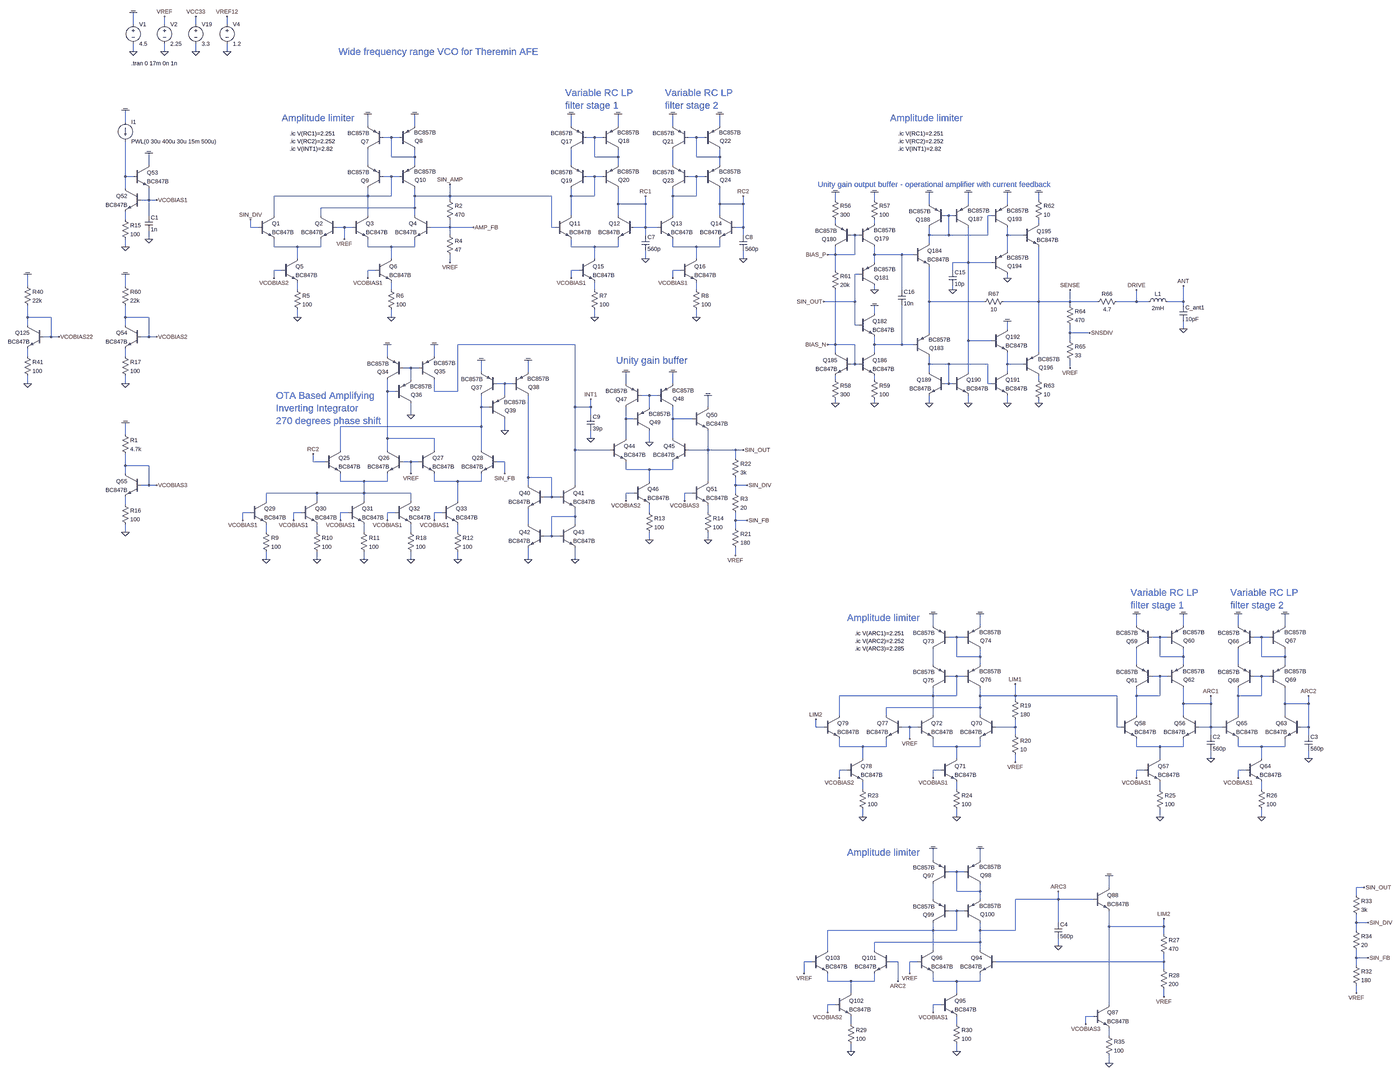
[diagram p0: schematic vco_sine_bjt_v01.asc, whole sheet]
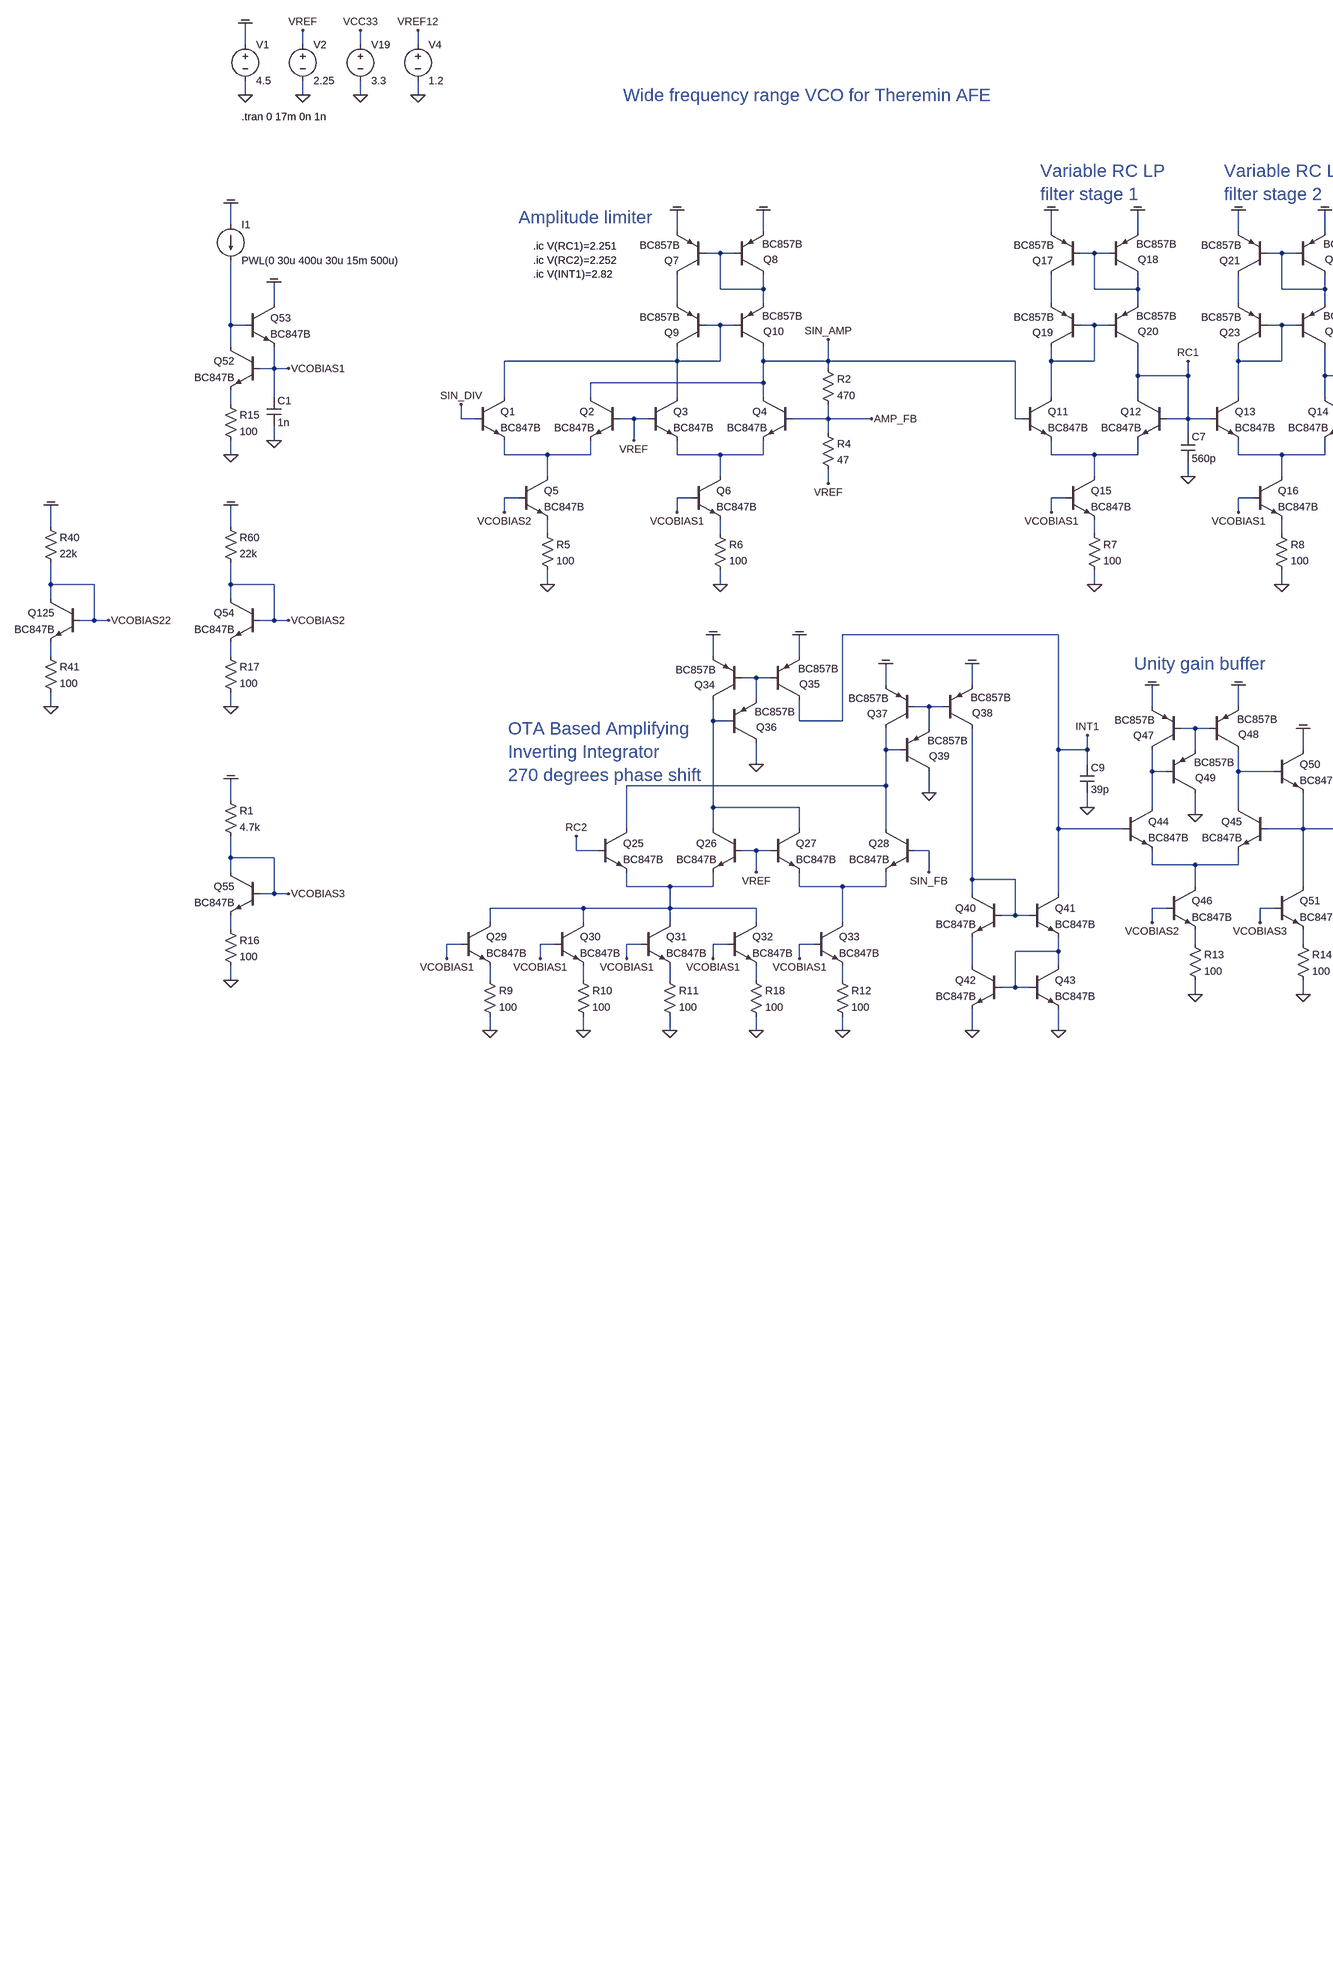
[diagram p1: schematic vco_sine_bjt_v01.asc, part, row 1 of 1, column 1 of 2]
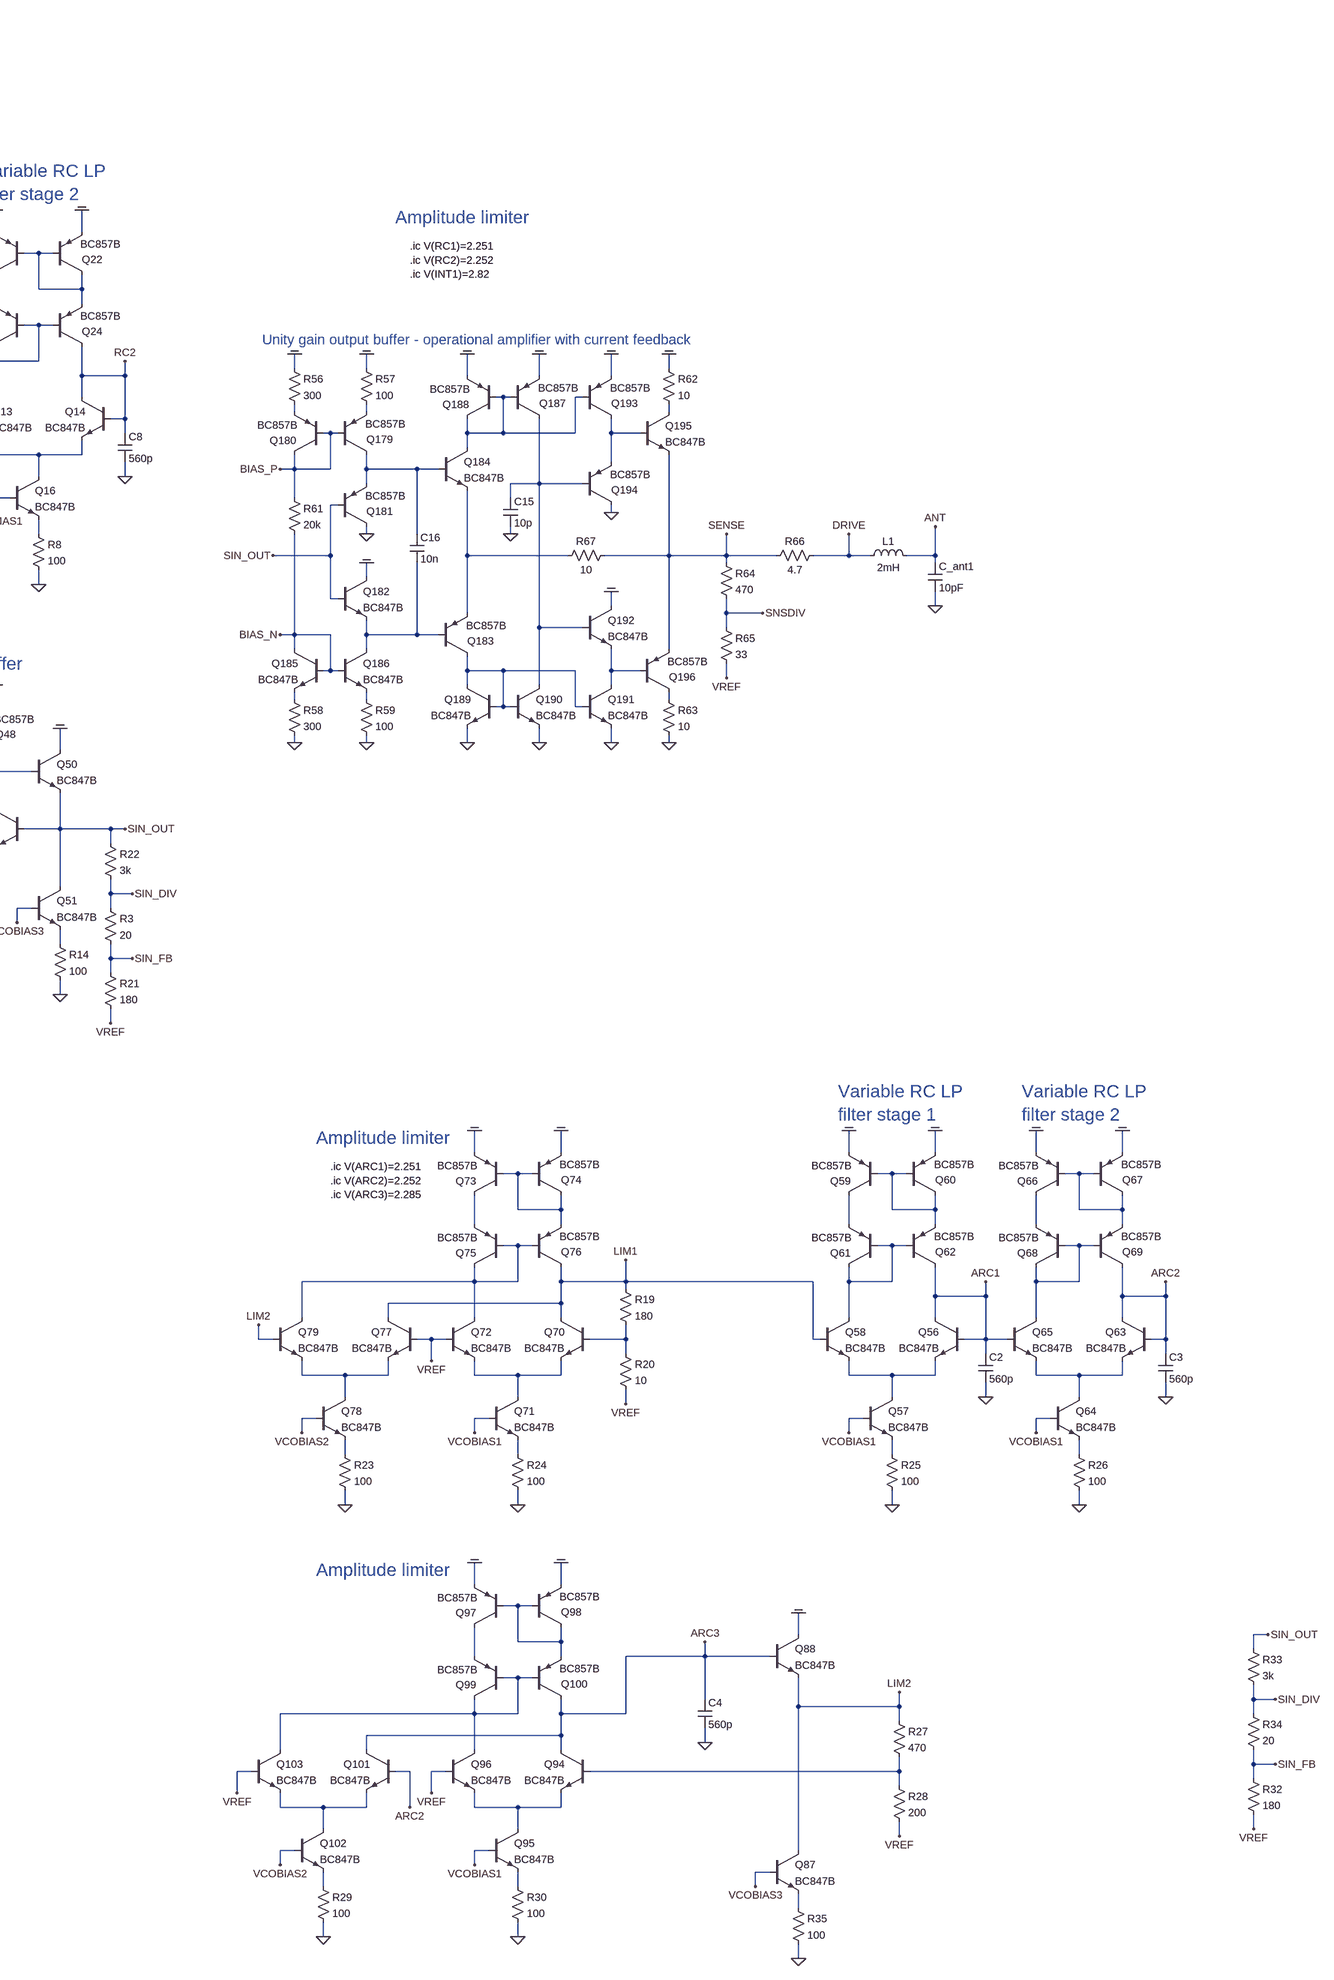
[diagram p2: schematic vco_sine_bjt_v01.asc, part, row 1 of 1, column 2 of 2]
vco_sine_bjt_v01.asc, the LTspice schematic file:
Version 4
SHEET 1 13504 19328
WIRE -432 13600 -432 13552
WIRE -304 13600 -304 13568
WIRE -176 13600 -176 13568
WIRE -48 13600 -48 13568
WIRE -432 13712 -432 13680
WIRE -304 13712 -304 13680
WIRE -176 13712 -176 13680
WIRE -48 13712 -48 13680
WIRE -464 14000 -464 13952
WIRE 528 14016 528 13968
WIRE 720 14016 720 13968
WIRE 1360 14016 1360 13968
WIRE 1552 14016 1552 13968
WIRE 1776 14016 1776 13968
WIRE 1968 14016 1968 13968
WIRE 624 14064 592 14064
WIRE 656 14064 624 14064
WIRE 1456 14064 1424 14064
WIRE 1488 14064 1456 14064
WIRE 1872 14064 1840 14064
WIRE 1904 14064 1872 14064
WIRE 624 14144 624 14064
WIRE 720 14144 720 14112
WIRE 720 14144 624 14144
WIRE 1456 14144 1456 14064
WIRE 1552 14144 1552 14112
WIRE 1552 14144 1456 14144
WIRE 1872 14144 1872 14064
WIRE 1968 14144 1968 14112
WIRE 1968 14144 1872 14144
WIRE -368 14176 -368 14128
WIRE 528 14176 528 14112
WIRE 720 14176 720 14144
WIRE 1360 14176 1360 14112
WIRE 1552 14176 1552 14144
WIRE 1776 14176 1776 14112
WIRE 1968 14176 1968 14144
WIRE -464 14224 -464 14080
WIRE -432 14224 -464 14224
WIRE 624 14224 592 14224
WIRE 656 14224 624 14224
WIRE 1456 14224 1424 14224
WIRE 1488 14224 1456 14224
WIRE 1872 14224 1840 14224
WIRE 1904 14224 1872 14224
WIRE -464 14272 -464 14224
WIRE 528 14304 528 14272
WIRE 528 14304 144 14304
WIRE 624 14304 624 14224
WIRE 624 14304 528 14304
WIRE 720 14304 720 14272
WIRE 864 14304 864 14256
WIRE 864 14304 720 14304
WIRE 1280 14304 864 14304
WIRE 1360 14304 1360 14272
WIRE 1456 14304 1456 14224
WIRE 1456 14304 1360 14304
WIRE 1776 14304 1776 14272
WIRE 1872 14304 1872 14224
WIRE 1872 14304 1776 14304
WIRE -368 14320 -368 14272
WIRE -368 14320 -400 14320
WIRE -336 14320 -368 14320
WIRE 864 14320 864 14304
WIRE 2576 14320 2576 14288
WIRE 2736 14320 2736 14288
WIRE 3408 14320 3408 14288
WIRE 1552 14336 1552 14272
WIRE 1664 14336 1664 14304
WIRE 1664 14336 1552 14336
WIRE 1968 14336 1968 14272
WIRE 2064 14336 2064 14304
WIRE 2064 14336 1968 14336
WIRE 2960 14336 2960 14288
WIRE 3120 14336 3120 14288
WIRE 3280 14336 3280 14288
WIRE 720 14352 720 14304
WIRE 720 14352 336 14352
WIRE -368 14384 -368 14320
WIRE 144 14384 144 14304
WIRE 336 14384 336 14352
WIRE 528 14384 528 14304
WIRE 720 14384 720 14352
WIRE 1360 14384 1360 14304
WIRE 1552 14384 1552 14336
WIRE 1776 14384 1776 14304
WIRE 1968 14384 1968 14336
WIRE 3040 14384 3024 14384
WIRE 3056 14384 3040 14384
WIRE 3216 14384 3200 14384
WIRE -464 14400 -464 14368
WIRE 2576 14416 2576 14400
WIRE 2736 14416 2736 14400
WIRE 3408 14416 3408 14400
WIRE 48 14432 48 14400
WIRE 80 14432 48 14432
WIRE 432 14432 400 14432
WIRE 464 14432 432 14432
WIRE 864 14432 864 14400
WIRE 864 14432 784 14432
WIRE 960 14432 864 14432
WIRE 1280 14432 1280 14304
WIRE 1296 14432 1280 14432
WIRE 1664 14432 1664 14336
WIRE 1664 14432 1616 14432
WIRE 1712 14432 1664 14432
WIRE 2064 14432 2064 14336
WIRE 2064 14432 2032 14432
WIRE 864 14464 864 14432
WIRE 1664 14464 1664 14432
WIRE 2064 14464 2064 14432
WIRE 2656 14464 2640 14464
WIRE 2672 14464 2656 14464
WIRE 2960 14464 2960 14432
WIRE 3040 14464 3040 14384
WIRE 3040 14464 2960 14464
WIRE 3200 14464 3200 14384
WIRE 3200 14464 3040 14464
WIRE 3280 14464 3280 14432
WIRE 3344 14464 3280 14464
WIRE -368 14480 -368 14448
WIRE 432 14480 432 14432
WIRE 2960 14496 2960 14464
WIRE -464 14512 -464 14480
WIRE 144 14512 144 14480
WIRE 240 14512 144 14512
WIRE 336 14512 336 14480
WIRE 336 14512 240 14512
WIRE 528 14512 528 14480
WIRE 624 14512 528 14512
WIRE 720 14512 720 14480
WIRE 720 14512 624 14512
WIRE 1360 14512 1360 14480
WIRE 1456 14512 1360 14512
WIRE 1552 14512 1552 14480
WIRE 1552 14512 1456 14512
WIRE 1776 14512 1776 14480
WIRE 1872 14512 1776 14512
WIRE 1968 14512 1968 14480
WIRE 1968 14512 1872 14512
WIRE 3280 14528 3280 14464
WIRE 2576 14544 2576 14512
WIRE 2576 14544 2544 14544
WIRE 2656 14544 2656 14464
WIRE 2656 14544 2576 14544
WIRE 2736 14544 2736 14512
WIRE 2848 14544 2736 14544
WIRE 2896 14544 2848 14544
WIRE 240 14560 240 14512
WIRE 624 14560 624 14512
WIRE 1456 14560 1456 14512
WIRE 1664 14560 1664 14528
WIRE 1872 14560 1872 14512
WIRE 2064 14560 2064 14528
WIRE 864 14576 864 14544
WIRE 2736 14576 2736 14544
WIRE 3120 14576 3120 14432
WIRE 3120 14576 3056 14576
WIRE 3216 14576 3120 14576
WIRE 176 14608 144 14608
WIRE 560 14608 528 14608
WIRE 1392 14608 1360 14608
WIRE 1808 14608 1776 14608
WIRE 2576 14608 2576 14544
WIRE 3056 14608 3056 14576
WIRE 2672 14624 2656 14624
WIRE 144 14640 144 14608
WIRE 528 14640 528 14608
WIRE 1360 14640 1360 14608
WIRE 1776 14640 1776 14608
WIRE 3280 14640 3280 14624
WIRE -864 14672 -864 14624
WIRE -464 14672 -464 14624
WIRE 240 14688 240 14656
WIRE 624 14688 624 14656
WIRE 1456 14688 1456 14656
WIRE 1872 14688 1872 14656
WIRE 2736 14688 2736 14672
WIRE 2848 14688 2848 14544
WIRE 3056 14688 3056 14672
WIRE 2656 14736 2656 14624
WIRE 2656 14736 2528 14736
WIRE 2960 14736 2960 14592
WIRE 3184 14736 2960 14736
WIRE 3408 14736 3408 14512
WIRE 3408 14736 3264 14736
WIRE 3536 14736 3536 14688
WIRE 3536 14736 3408 14736
WIRE 3648 14736 3536 14736
WIRE 3808 14736 3808 14688
WIRE 3808 14736 3728 14736
WIRE 3856 14736 3808 14736
WIRE 4000 14736 4000 14672
WIRE 4000 14736 3936 14736
WIRE 3536 14752 3536 14736
WIRE 4000 14752 4000 14736
WIRE 2736 14784 2736 14752
WIRE -864 14800 -864 14752
WIRE -768 14800 -864 14800
WIRE -464 14800 -464 14752
WIRE -368 14800 -464 14800
WIRE 240 14800 240 14768
WIRE 624 14800 624 14768
WIRE 1456 14800 1456 14768
WIRE 1872 14800 1872 14768
WIRE -864 14832 -864 14800
WIRE -464 14832 -464 14800
WIRE 2656 14832 2656 14736
WIRE 2672 14832 2656 14832
WIRE 3280 14848 3280 14816
WIRE 4000 14848 4000 14816
WIRE 2960 14864 2960 14736
WIRE 3536 14864 3536 14832
WIRE 3616 14864 3536 14864
WIRE -768 14880 -768 14800
WIRE -768 14880 -800 14880
WIRE -736 14880 -768 14880
WIRE -368 14880 -368 14800
WIRE -368 14880 -400 14880
WIRE -336 14880 -368 14880
WIRE 3120 14896 3120 14576
WIRE 3216 14896 3120 14896
WIRE 3536 14896 3536 14864
WIRE 1376 14912 896 14912
WIRE 2576 14912 2576 14688
WIRE 2576 14912 2544 14912
WIRE 2656 14912 2576 14912
WIRE 2736 14912 2736 14880
WIRE 2848 14912 2848 14752
WIRE 2848 14912 2736 14912
WIRE 2896 14912 2848 14912
WIRE 2576 14944 2576 14912
WIRE 2736 14944 2736 14912
WIRE 3408 14944 3408 14736
WIRE -864 14960 -864 14928
WIRE -464 14960 -464 14928
WIRE 608 14960 608 14912
WIRE 800 14960 800 14912
WIRE 2656 14992 2656 14912
WIRE 2656 14992 2640 14992
WIRE 2672 14992 2656 14992
WIRE 2960 14992 2960 14960
WIRE 3040 14992 2960 14992
WIRE 3200 14992 3040 14992
WIRE 3280 14992 3280 14944
WIRE 3344 14992 3280 14992
WIRE 704 15008 672 15008
WIRE 736 15008 704 15008
WIRE 3536 15008 3536 14976
WIRE 992 15024 992 14976
WIRE 1184 15024 1184 14976
WIRE 2960 15024 2960 14992
WIRE 3120 15024 3120 14896
WIRE 3280 15024 3280 14992
WIRE 704 15056 704 15008
WIRE 2576 15056 2576 15040
WIRE 2736 15056 2736 15040
WIRE 3408 15056 3408 15040
WIRE -864 15072 -864 15040
WIRE -464 15072 -464 15040
WIRE 1088 15072 1056 15072
WIRE 1120 15072 1088 15072
WIRE 1584 15072 1584 15024
WIRE 1776 15072 1776 15024
WIRE 3040 15072 3040 14992
WIRE 3040 15072 3024 15072
WIRE 3056 15072 3040 15072
WIRE 3200 15072 3200 14992
WIRE 3216 15072 3200 15072
WIRE 608 15104 608 15056
WIRE 640 15104 608 15104
WIRE 800 15104 800 15056
WIRE 896 15104 896 14912
WIRE 896 15104 800 15104
WIRE 1088 15120 1088 15072
WIRE 1680 15120 1648 15120
WIRE 1712 15120 1680 15120
WIRE 2576 15152 2576 15136
WIRE 2736 15152 2736 15136
WIRE 2960 15152 2960 15120
WIRE 3120 15152 3120 15120
WIRE 3280 15152 3280 15120
WIRE 3408 15152 3408 15136
WIRE 992 15168 992 15120
WIRE 1024 15168 992 15168
WIRE 1376 15168 1376 14912
WIRE 1440 15168 1440 15136
WIRE 1440 15168 1376 15168
WIRE 1680 15168 1680 15120
WIRE 1920 15168 1920 15120
WIRE 704 15200 704 15152
WIRE 1440 15200 1440 15168
WIRE 1584 15216 1584 15168
WIRE 1616 15216 1584 15216
WIRE 1776 15216 1776 15168
WIRE 1856 15216 1776 15216
WIRE 992 15248 992 15168
WIRE 992 15248 416 15248
WIRE 1088 15264 1088 15216
WIRE -464 15280 -464 15232
WIRE 608 15296 608 15104
WIRE 800 15296 608 15296
WIRE 1440 15296 1440 15264
WIRE 1584 15296 1584 15216
WIRE 1776 15296 1776 15216
WIRE 1680 15312 1680 15264
WIRE 416 15344 416 15248
WIRE 608 15344 608 15296
WIRE 800 15344 800 15296
WIRE 992 15344 992 15248
WIRE 1376 15344 1376 15168
WIRE 1520 15344 1376 15344
WIRE 1920 15344 1920 15264
WIRE 1920 15344 1840 15344
WIRE 2032 15344 1920 15344
WIRE 2064 15344 2032 15344
WIRE 2032 15376 2032 15344
WIRE 304 15392 304 15360
WIRE 352 15392 304 15392
WIRE 704 15392 672 15392
WIRE 736 15392 704 15392
WIRE 1088 15392 1056 15392
WIRE -464 15408 -464 15360
WIRE -368 15408 -464 15408
WIRE 1584 15424 1584 15392
WIRE 1680 15424 1584 15424
WIRE 1776 15424 1776 15392
WIRE 1776 15424 1680 15424
WIRE -464 15440 -464 15408
WIRE 704 15440 704 15392
WIRE 1088 15440 1088 15392
WIRE 1184 15456 1184 15120
WIRE 1280 15456 1184 15456
WIRE 416 15472 416 15440
WIRE 512 15472 416 15472
WIRE 608 15472 608 15440
WIRE 608 15472 512 15472
WIRE 800 15472 800 15440
WIRE 896 15472 800 15472
WIRE 992 15472 992 15440
WIRE 992 15472 896 15472
WIRE 1680 15472 1680 15424
WIRE 1920 15472 1920 15344
WIRE -368 15488 -368 15408
WIRE -368 15488 -400 15488
WIRE -336 15488 -368 15488
WIRE 1184 15488 1184 15456
WIRE 1376 15488 1376 15344
WIRE 2032 15488 2032 15456
WIRE 2080 15488 2032 15488
WIRE 320 15520 112 15520
WIRE 512 15520 512 15472
WIRE 512 15520 320 15520
WIRE 704 15520 512 15520
WIRE 1616 15520 1584 15520
WIRE 1856 15520 1824 15520
WIRE 2032 15520 2032 15488
WIRE 1280 15536 1280 15456
WIRE 1280 15536 1248 15536
WIRE 1312 15536 1280 15536
WIRE 112 15552 112 15520
WIRE 320 15552 320 15520
WIRE 512 15552 512 15520
WIRE 704 15552 704 15520
WIRE 896 15552 896 15472
WIRE 1584 15552 1584 15520
WIRE 1824 15552 1824 15520
WIRE -464 15568 -464 15536
WIRE 48 15600 16 15600
WIRE 256 15600 224 15600
WIRE 448 15600 416 15600
WIRE 640 15600 608 15600
WIRE 832 15600 800 15600
WIRE 1680 15600 1680 15568
WIRE 1920 15600 1920 15568
WIRE 1376 15616 1376 15584
WIRE 1376 15616 1280 15616
WIRE 16 15632 16 15600
WIRE 224 15632 224 15600
WIRE 416 15632 416 15600
WIRE 608 15632 608 15600
WIRE 800 15632 800 15600
WIRE 2032 15632 2032 15600
WIRE 2080 15632 2032 15632
WIRE 1184 15648 1184 15584
WIRE 1376 15648 1376 15616
WIRE 2032 15664 2032 15632
WIRE -464 15680 -464 15648
WIRE 112 15680 112 15648
WIRE 320 15680 320 15648
WIRE 512 15680 512 15648
WIRE 704 15680 704 15648
WIRE 896 15680 896 15648
WIRE 1280 15696 1280 15616
WIRE 1280 15696 1248 15696
WIRE 1312 15696 1280 15696
WIRE 1680 15712 1680 15680
WIRE 1920 15712 1920 15680
WIRE 2032 15776 2032 15744
WIRE 112 15792 112 15760
WIRE 320 15792 320 15760
WIRE 512 15792 512 15760
WIRE 704 15792 704 15760
WIRE 896 15792 896 15760
WIRE 1184 15792 1184 15744
WIRE 1376 15792 1376 15744
WIRE 2976 16176 2976 16128
WIRE 3168 16176 3168 16128
WIRE 3808 16176 3808 16128
WIRE 4000 16176 4000 16128
WIRE 4224 16176 4224 16128
WIRE 4416 16176 4416 16128
WIRE 3072 16224 3040 16224
WIRE 3104 16224 3072 16224
WIRE 3904 16224 3872 16224
WIRE 3936 16224 3904 16224
WIRE 4320 16224 4288 16224
WIRE 4352 16224 4320 16224
WIRE 3072 16304 3072 16224
WIRE 3168 16304 3168 16272
WIRE 3168 16304 3072 16304
WIRE 3904 16304 3904 16224
WIRE 4000 16304 4000 16272
WIRE 4000 16304 3904 16304
WIRE 4320 16304 4320 16224
WIRE 4416 16304 4416 16272
WIRE 4416 16304 4320 16304
WIRE 2976 16336 2976 16272
WIRE 3168 16336 3168 16304
WIRE 3808 16336 3808 16272
WIRE 4000 16336 4000 16304
WIRE 4224 16336 4224 16272
WIRE 4416 16336 4416 16304
WIRE 3072 16384 3040 16384
WIRE 3104 16384 3072 16384
WIRE 3904 16384 3872 16384
WIRE 3936 16384 3904 16384
WIRE 4320 16384 4288 16384
WIRE 4352 16384 4320 16384
WIRE 2976 16464 2976 16432
WIRE 2976 16464 2592 16464
WIRE 3072 16464 3072 16384
WIRE 3072 16464 2976 16464
WIRE 3168 16464 3168 16432
WIRE 3312 16464 3312 16416
WIRE 3312 16464 3168 16464
WIRE 3728 16464 3312 16464
WIRE 3808 16464 3808 16432
WIRE 3904 16464 3904 16384
WIRE 3904 16464 3808 16464
WIRE 4224 16464 4224 16432
WIRE 4320 16464 4320 16384
WIRE 4320 16464 4224 16464
WIRE 3312 16480 3312 16464
WIRE 4000 16496 4000 16432
WIRE 4112 16496 4112 16464
WIRE 4112 16496 4000 16496
WIRE 4416 16496 4416 16432
WIRE 4512 16496 4512 16464
WIRE 4512 16496 4416 16496
WIRE 3168 16512 3168 16464
WIRE 3168 16512 2784 16512
WIRE 2592 16544 2592 16464
WIRE 2784 16544 2784 16512
WIRE 2976 16544 2976 16464
WIRE 3168 16544 3168 16512
WIRE 3808 16544 3808 16464
WIRE 4000 16544 4000 16496
WIRE 4224 16544 4224 16464
WIRE 4416 16544 4416 16496
WIRE 2496 16592 2496 16560
WIRE 2528 16592 2496 16592
WIRE 2880 16592 2848 16592
WIRE 2912 16592 2880 16592
WIRE 3312 16592 3312 16560
WIRE 3312 16592 3232 16592
WIRE 3728 16592 3728 16464
WIRE 3744 16592 3728 16592
WIRE 4112 16592 4112 16496
WIRE 4112 16592 4064 16592
WIRE 4160 16592 4112 16592
WIRE 4512 16592 4512 16496
WIRE 4512 16592 4480 16592
WIRE 3312 16624 3312 16592
WIRE 4112 16624 4112 16592
WIRE 4512 16624 4512 16592
WIRE 2880 16640 2880 16592
WIRE 2592 16672 2592 16640
WIRE 2688 16672 2592 16672
WIRE 2784 16672 2784 16640
WIRE 2784 16672 2688 16672
WIRE 2976 16672 2976 16640
WIRE 3072 16672 2976 16672
WIRE 3168 16672 3168 16640
WIRE 3168 16672 3072 16672
WIRE 3808 16672 3808 16640
WIRE 3904 16672 3808 16672
WIRE 4000 16672 4000 16640
WIRE 4000 16672 3904 16672
WIRE 4224 16672 4224 16640
WIRE 4320 16672 4224 16672
WIRE 4416 16672 4416 16640
WIRE 4416 16672 4320 16672
WIRE 2688 16720 2688 16672
WIRE 3072 16720 3072 16672
WIRE 3904 16720 3904 16672
WIRE 4112 16720 4112 16688
WIRE 4320 16720 4320 16672
WIRE 4512 16720 4512 16688
WIRE 3312 16736 3312 16704
WIRE 2624 16768 2592 16768
WIRE 3008 16768 2976 16768
WIRE 3840 16768 3808 16768
WIRE 4256 16768 4224 16768
WIRE 2592 16800 2592 16768
WIRE 2976 16800 2976 16768
WIRE 3808 16800 3808 16768
WIRE 4224 16800 4224 16768
WIRE 2688 16848 2688 16816
WIRE 3072 16848 3072 16816
WIRE 3904 16848 3904 16816
WIRE 4320 16848 4320 16816
WIRE 2688 16960 2688 16928
WIRE 3072 16960 3072 16928
WIRE 3904 16960 3904 16928
WIRE 4320 16960 4320 16928
WIRE 2976 17200 2976 17152
WIRE 3168 17200 3168 17152
WIRE 3072 17248 3040 17248
WIRE 3104 17248 3072 17248
WIRE 3696 17312 3696 17264
WIRE 5248 17312 5216 17312
WIRE 3072 17328 3072 17248
WIRE 3168 17328 3168 17296
WIRE 3168 17328 3072 17328
WIRE 5216 17344 5216 17312
WIRE 2976 17360 2976 17296
WIRE 3168 17360 3168 17328
WIRE 3488 17360 3488 17328
WIRE 3488 17360 3312 17360
WIRE 3632 17360 3488 17360
WIRE 3072 17408 3040 17408
WIRE 3104 17408 3072 17408
WIRE 3488 17456 3488 17360
WIRE 5216 17456 5216 17424
WIRE 5264 17456 5216 17456
WIRE 3696 17472 3696 17408
WIRE 3920 17472 3920 17440
WIRE 3920 17472 3696 17472
WIRE 2976 17488 2976 17456
WIRE 2976 17488 2544 17488
WIRE 3072 17488 3072 17408
WIRE 3072 17488 2976 17488
WIRE 3168 17488 3168 17456
WIRE 3312 17488 3312 17360
WIRE 3312 17488 3168 17488
WIRE 5216 17488 5216 17456
WIRE 3920 17504 3920 17472
WIRE 3168 17536 3168 17488
WIRE 3168 17536 2736 17536
WIRE 3488 17552 3488 17520
WIRE 2544 17568 2544 17488
WIRE 2736 17568 2736 17536
WIRE 2976 17568 2976 17488
WIRE 3168 17568 3168 17536
WIRE 5216 17600 5216 17568
WIRE 5264 17600 5216 17600
WIRE 2480 17616 2448 17616
WIRE 2832 17616 2800 17616
WIRE 2912 17616 2880 17616
WIRE 3920 17616 3920 17584
WIRE 3920 17616 3232 17616
WIRE 5216 17632 5216 17600
WIRE 3920 17648 3920 17616
WIRE 2448 17664 2448 17616
WIRE 2880 17664 2880 17616
WIRE 2544 17696 2544 17664
WIRE 2640 17696 2544 17696
WIRE 2736 17696 2736 17664
WIRE 2736 17696 2640 17696
WIRE 2832 17696 2832 17616
WIRE 2976 17696 2976 17664
WIRE 3072 17696 2976 17696
WIRE 3168 17696 3168 17664
WIRE 3168 17696 3072 17696
WIRE 2640 17744 2640 17696
WIRE 3072 17744 3072 17696
WIRE 5216 17744 5216 17712
WIRE 3920 17760 3920 17728
WIRE 2576 17792 2544 17792
WIRE 3008 17792 2976 17792
WIRE 3696 17792 3696 17472
WIRE 2544 17824 2544 17792
WIRE 2976 17824 2976 17792
WIRE 3632 17840 3600 17840
WIRE 2640 17872 2640 17840
WIRE 3072 17872 3072 17840
WIRE 3600 17872 3600 17840
WIRE 3696 17920 3696 17888
WIRE 2640 17984 2640 17952
WIRE 3072 17984 3072 17952
WIRE 3696 18032 3696 18000
FLAG -432 13712 0
FLAG -432 13552 COM
FLAG -304 13712 0
FLAG -304 13568 VREF
FLAG -176 13712 0
FLAG -176 13568 VCC33
FLAG -48 13712 0
FLAG -48 13568 VREF12
FLAG -336 14320 VCOBIAS1
FLAG -464 14624 COM
FLAG -464 15232 COM
FLAG -464 13952 COM
FLAG -336 14880 VCOBIAS2
FLAG -336 15488 VCOBIAS3
FLAG -368 14128 COM
FLAG 1360 14640 VCOBIAS1
FLAG 1360 13968 COM
FLAG 1552 13968 COM
FLAG 1664 14304 RC1
FLAG 1664 14560 0
FLAG 1776 14640 VCOBIAS1
FLAG 1776 13968 COM
FLAG 1968 13968 COM
FLAG 2064 14304 RC2
FLAG 2064 14560 0
FLAG 224 15632 VCOBIAS1
FLAG 800 15632 VCOBIAS1
FLAG 992 14976 COM
FLAG 1184 14976 COM
FLAG 1440 15136 INT1
FLAG 704 15440 VREF
FLAG 1440 15296 0
FLAG 1824 15552 VCOBIAS3
FLAG 1920 15120 COM
FLAG 2032 15776 VREF
FLAG 608 14912 COM
FLAG 800 14912 COM
FLAG 1184 15792 0
FLAG 1376 15792 0
FLAG 1584 15552 VCOBIAS2
FLAG 1584 15024 COM
FLAG 1776 15024 COM
FLAG 1680 15312 0
FLAG 16 15632 VCOBIAS1
FLAG 704 15200 0
FLAG 1088 15264 0
FLAG 416 15632 VCOBIAS1
FLAG 528 14640 VCOBIAS1
FLAG 528 13968 COM
FLAG 720 13968 COM
FLAG 864 14576 VREF
FLAG 864 14256 SIN_AMP
FLAG 240 14800 0
FLAG 144 14640 VCOBIAS2
FLAG 432 14480 VREF
FLAG 2064 15344 SIN_OUT
FLAG 2080 15488 SIN_DIV
FLAG 48 14400 SIN_DIV
FLAG 304 15360 RC2
FLAG 2080 15632 SIN_FB
FLAG 624 14800 0
FLAG 1456 14800 0
FLAG 1872 14800 0
FLAG 112 15792 0
FLAG 320 15792 0
FLAG 512 15792 0
FLAG 896 15792 0
FLAG 1680 15712 0
FLAG 1920 15712 0
FLAG -464 14512 0
FLAG -464 15680 0
FLAG -464 15072 0
FLAG 1088 15440 SIN_FB
FLAG -368 14480 0
FLAG 608 15632 VCOBIAS1
FLAG 704 15792 0
FLAG -864 14624 COM
FLAG -736 14880 VCOBIAS22
FLAG -864 15072 0
FLAG 2576 15152 0
FLAG 2736 15152 0
FLAG 2736 14288 COM
FLAG 2576 14288 COM
FLAG 2736 14688 0
FLAG 2736 14752 COM
FLAG 2544 14912 BIAS_N
FLAG 2544 14544 BIAS_P
FLAG 3120 14288 COM
FLAG 2960 14288 COM
FLAG 2960 15152 0
FLAG 3120 15152 0
FLAG 3056 14688 0
FLAG 3280 15152 0
FLAG 3280 14816 COM
FLAG 3280 14288 COM
FLAG 3280 14640 0
FLAG 3408 14288 COM
FLAG 3408 15152 0
FLAG 3536 15008 VREF
FLAG 2528 14736 SIN_OUT
FLAG 4000 14848 0
FLAG 4000 14672 ANT
FLAG 3808 14688 DRIVE
FLAG 3536 14688 SENSE
FLAG 3616 14864 SNSDIV
FLAG 960 14432 AMP_FB
FLAG 3808 16800 VCOBIAS1
FLAG 3808 16128 COM
FLAG 4000 16128 COM
FLAG 4112 16464 ARC1
FLAG 4112 16720 0
FLAG 4224 16800 VCOBIAS1
FLAG 4224 16128 COM
FLAG 4416 16128 COM
FLAG 4512 16464 ARC2
FLAG 4512 16720 0
FLAG 2976 16800 VCOBIAS1
FLAG 2976 16128 COM
FLAG 3168 16128 COM
FLAG 3312 16736 VREF
FLAG 3312 16416 LIM1
FLAG 2688 16960 0
FLAG 2592 16800 VCOBIAS2
FLAG 2880 16640 VREF
FLAG 2496 16560 LIM2
FLAG 3072 16960 0
FLAG 3904 16960 0
FLAG 4320 16960 0
FLAG 3488 17328 ARC3
FLAG 3488 17552 0
FLAG 2976 17824 VCOBIAS1
FLAG 2976 17152 COM
FLAG 3168 17152 COM
FLAG 3920 17760 VREF
FLAG 3920 17440 LIM2
FLAG 2640 17984 0
FLAG 2544 17824 VCOBIAS2
FLAG 2880 17664 VREF
FLAG 3072 17984 0
FLAG 2832 17696 ARC2
FLAG 2448 17664 VREF
FLAG 5216 17744 VREF
FLAG 5248 17312 SIN_OUT
FLAG 5264 17456 SIN_DIV
FLAG 5264 17600 SIN_FB
FLAG 3600 17872 VCOBIAS3
FLAG 3696 17264 COM
FLAG 3696 18032 0
SYMBOL voltage -432 13584 R0
SYMATTR InstName V1
SYMATTR Value 4.5
SYMBOL Voltage -304 13584 R0
SYMATTR InstName V2
SYMATTR Value 2.25
SYMBOL Voltage -176 13584 R0
SYMATTR InstName V19
SYMATTR Value 3.3
SYMBOL Voltage -48 13584 R0
SYMATTR InstName V4
SYMATTR Value 1.2
SYMBOL npn -400 14272 M0
SYMATTR InstName Q52
SYMATTR Value BC847B
SYMBOL Res -480 14656 R0
SYMATTR InstName R60
SYMATTR Value 22k
SYMBOL Res -480 15264 R0
SYMATTR InstName R1
SYMATTR Value 4.7k
SYMBOL current -464 14000 R0
SYMATTR InstName I1
SYMATTR Value PWL(0 30u 400u 30u 15m 500u)
SYMBOL npn -400 14832 M0
SYMATTR InstName Q54
SYMATTR Value BC847B
SYMBOL npn -400 15440 M0
SYMATTR InstName Q55
SYMATTR Value BC847B
SYMBOL npn -432 14176 R0
SYMATTR InstName Q53
SYMATTR Value BC847B
SYMBOL npn 1616 14384 M0
SYMATTR InstName Q12
SYMATTR Value BC847B
SYMBOL npn 1392 14560 R0
SYMATTR InstName Q15
SYMATTR Value BC847B
SYMBOL npn 1296 14384 R0
SYMATTR InstName Q11
SYMATTR Value BC847B
SYMBOL pnp 1424 14112 R180
WINDOW 0 60 32 Left 2
WINDOW 3 58 66 Left 2
SYMATTR InstName Q17
SYMATTR Value BC857B
SYMBOL pnp 1488 14112 M180
WINDOW 0 64 34 Left 2
WINDOW 3 61 68 Left 2
SYMATTR InstName Q18
SYMATTR Value BC857B
SYMBOL pnp 1424 14272 R180
WINDOW 0 60 32 Left 2
WINDOW 3 58 66 Left 2
SYMATTR InstName Q19
SYMATTR Value BC857B
SYMBOL pnp 1488 14272 M180
WINDOW 0 64 34 Left 2
WINDOW 3 61 68 Left 2
SYMATTR InstName Q20
SYMATTR Value BC857B
SYMBOL Cap 1648 14464 R0
SYMATTR InstName C7
SYMATTR Value 560p
SYMBOL npn 2032 14384 M0
SYMATTR InstName Q14
SYMATTR Value BC847B
SYMBOL npn 1808 14560 R0
SYMATTR InstName Q16
SYMATTR Value BC847B
SYMBOL npn 1712 14384 R0
SYMATTR InstName Q13
SYMATTR Value BC847B
SYMBOL pnp 1840 14112 R180
WINDOW 0 60 32 Left 2
WINDOW 3 58 66 Left 2
SYMATTR InstName Q21
SYMATTR Value BC857B
SYMBOL pnp 1904 14112 M180
WINDOW 0 64 34 Left 2
WINDOW 3 61 68 Left 2
SYMATTR InstName Q22
SYMATTR Value BC857B
SYMBOL pnp 1840 14272 R180
WINDOW 0 60 32 Left 2
WINDOW 3 58 66 Left 2
SYMATTR InstName Q23
SYMATTR Value BC857B
SYMBOL pnp 1904 14272 M180
WINDOW 0 64 34 Left 2
WINDOW 3 61 68 Left 2
SYMATTR InstName Q24
SYMATTR Value BC857B
SYMBOL Cap 2048 14464 R0
SYMATTR InstName C8
SYMATTR Value 560p
SYMBOL npn 672 15344 M0
SYMATTR InstName Q26
SYMATTR Value BC847B
SYMBOL npn 256 15552 R0
SYMATTR InstName Q30
SYMATTR Value BC847B
SYMBOL npn 352 15344 R0
SYMATTR InstName Q25
SYMATTR Value BC847B
SYMBOL npn 1056 15344 M0
SYMATTR InstName Q28
SYMATTR Value BC847B
SYMBOL npn 832 15552 R0
SYMATTR InstName Q33
SYMATTR Value BC847B
SYMBOL npn 736 15344 R0
SYMATTR InstName Q27
SYMATTR Value BC847B
SYMBOL pnp 1056 15120 R180
WINDOW 0 60 32 Left 2
WINDOW 3 58 66 Left 2
SYMATTR InstName Q37
SYMATTR Value BC857B
SYMBOL pnp 1120 15120 M180
WINDOW 0 64 34 Left 2
WINDOW 3 61 68 Left 2
SYMATTR InstName Q38
SYMATTR Value BC857B
SYMBOL Cap 1424 15200 R0
SYMATTR InstName C9
SYMATTR Value 39p
SYMBOL npn 1856 15472 R0
SYMATTR InstName Q51
SYMATTR Value BC847B
SYMBOL Res 2016 15648 R0
SYMATTR InstName R21
SYMATTR Value 180
SYMBOL Res 2016 15360 R0
SYMATTR InstName R22
SYMATTR Value 3k
SYMBOL pnp 672 15056 R180
WINDOW 0 60 32 Left 2
WINDOW 3 58 66 Left 2
SYMATTR InstName Q34
SYMATTR Value BC857B
SYMBOL pnp 736 15056 M180
WINDOW 0 64 34 Left 2
WINDOW 3 61 68 Left 2
SYMATTR InstName Q35
SYMATTR Value BC857B
SYMBOL npn 1248 15488 M0
SYMATTR InstName Q40
SYMATTR Value BC847B
SYMBOL npn 1312 15488 R0
SYMATTR InstName Q41
SYMATTR Value BC847B
SYMBOL npn 1248 15648 M0
SYMATTR InstName Q42
SYMATTR Value BC847B
SYMBOL npn 1312 15648 R0
SYMATTR InstName Q43
SYMATTR Value BC847B
SYMBOL npn 1856 15168 R0
SYMATTR InstName Q50
SYMATTR Value BC847B
SYMBOL npn 1840 15296 M0
SYMATTR InstName Q45
SYMATTR Value BC847B
SYMBOL npn 1616 15472 R0
SYMATTR InstName Q46
SYMATTR Value BC847B
SYMBOL npn 1520 15296 R0
SYMATTR InstName Q44
SYMATTR Value BC847B
SYMBOL pnp 1648 15168 R180
WINDOW 0 60 32 Left 2
WINDOW 3 58 66 Left 2
SYMATTR InstName Q47
SYMATTR Value BC857B
SYMBOL pnp 1712 15168 M180
WINDOW 0 64 34 Left 2
WINDOW 3 61 68 Left 2
SYMATTR InstName Q48
SYMATTR Value BC857B
SYMBOL pnp 1616 15264 M180
WINDOW 0 64 34 Left 2
WINDOW 3 61 68 Left 2
SYMATTR InstName Q49
SYMATTR Value BC857B
SYMBOL npn 48 15552 R0
SYMATTR InstName Q29
SYMATTR Value BC847B
SYMBOL Res 2016 15504 R0
SYMATTR InstName R3
SYMATTR Value 20
SYMBOL pnp 640 15152 M180
WINDOW 0 64 34 Left 2
WINDOW 3 61 68 Left 2
SYMATTR InstName Q36
SYMATTR Value BC857B
SYMBOL pnp 1024 15216 M180
WINDOW 0 64 34 Left 2
WINDOW 3 61 68 Left 2
SYMATTR InstName Q39
SYMATTR Value BC857B
SYMBOL npn 448 15552 R0
SYMATTR InstName Q31
SYMATTR Value BC847B
SYMBOL npn 784 14384 M0
SYMATTR InstName Q4
SYMATTR Value BC847B
SYMBOL npn 560 14560 R0
SYMATTR InstName Q6
SYMATTR Value BC847B
SYMBOL npn 464 14384 R0
SYMATTR InstName Q3
SYMATTR Value BC847B
SYMBOL pnp 592 14112 R180
WINDOW 0 60 32 Left 2
WINDOW 3 58 66 Left 2
SYMATTR InstName Q7
SYMATTR Value BC857B
SYMBOL pnp 656 14112 M180
WINDOW 0 64 34 Left 2
WINDOW 3 61 68 Left 2
SYMATTR InstName Q8
SYMATTR Value BC857B
SYMBOL pnp 592 14272 R180
WINDOW 0 60 32 Left 2
WINDOW 3 58 66 Left 2
SYMATTR InstName Q9
SYMATTR Value BC857B
SYMBOL pnp 656 14272 M180
WINDOW 0 64 34 Left 2
WINDOW 3 61 68 Left 2
SYMATTR InstName Q10
SYMATTR Value BC857B
SYMBOL Res 848 14304 R0
SYMATTR InstName R2
SYMATTR Value 470
SYMBOL npn 400 14384 M0
SYMATTR InstName Q2
SYMATTR Value BC847B
SYMBOL npn 176 14560 R0
SYMATTR InstName Q5
SYMATTR Value BC847B
SYMBOL npn 80 14384 R0
SYMATTR InstName Q1
SYMATTR Value BC847B
SYMBOL Res 848 14448 R0
SYMATTR InstName R4
SYMATTR Value 47
SYMBOL Res 224 14672 R0
SYMATTR InstName R5
SYMATTR Value 100
SYMBOL Res 608 14672 R0
SYMATTR InstName R6
SYMATTR Value 100
SYMBOL Res 1440 14672 R0
SYMATTR InstName R7
SYMATTR Value 100
SYMBOL Res 1856 14672 R0
SYMATTR InstName R8
SYMATTR Value 100
SYMBOL Res 96 15664 R0
SYMATTR InstName R9
SYMATTR Value 100
SYMBOL Res 304 15664 R0
SYMATTR InstName R10
SYMATTR Value 100
SYMBOL Res 496 15664 R0
SYMATTR InstName R11
SYMATTR Value 100
SYMBOL Res 880 15664 R0
SYMATTR InstName R12
SYMATTR Value 100
SYMBOL Res 1664 15584 R0
SYMATTR InstName R13
SYMATTR Value 100
SYMBOL Res 1904 15584 R0
SYMATTR InstName R14
SYMATTR Value 100
SYMBOL Res -480 14384 R0
SYMATTR InstName R15
SYMATTR Value 100
SYMBOL Res -480 15552 R0
SYMATTR InstName R16
SYMATTR Value 100
SYMBOL Res -480 14944 R0
SYMATTR InstName R17
SYMATTR Value 100
SYMBOL Cap -384 14384 R0
SYMATTR InstName C1
SYMATTR Value 1n
SYMBOL npn 640 15552 R0
SYMATTR InstName Q32
SYMATTR Value BC847B
SYMBOL Res 688 15664 R0
SYMATTR InstName R18
SYMATTR Value 100
SYMBOL Res -880 14656 R0
SYMATTR InstName R40
SYMATTR Value 22k
SYMBOL npn -800 14832 M0
SYMATTR InstName Q125
SYMATTR Value BC847B
SYMBOL Res -880 14944 R0
SYMATTR InstName R41
SYMATTR Value 100
SYMBOL pnp 2672 14512 M180
WINDOW 0 64 34 Left 2
WINDOW 3 61 68 Left 2
SYMATTR InstName Q179
SYMATTR Value BC857B
SYMBOL pnp 2640 14512 R180
WINDOW 0 60 32 Left 2
WINDOW 3 58 66 Left 2
SYMATTR InstName Q180
SYMATTR Value BC857B
SYMBOL pnp 2672 14672 M180
WINDOW 0 64 34 Left 2
WINDOW 3 61 68 Left 2
SYMATTR InstName Q181
SYMATTR Value BC857B
SYMBOL npn 2672 14784 R0
SYMATTR InstName Q182
SYMATTR Value BC847B
SYMBOL pnp 2896 14960 M180
WINDOW 0 64 34 Left 2
WINDOW 3 61 68 Left 2
SYMATTR InstName Q183
SYMATTR Value BC857B
SYMBOL npn 2896 14496 R0
SYMATTR InstName Q184
SYMATTR Value BC847B
SYMBOL Res 2560 14304 R0
SYMATTR InstName R56
SYMATTR Value 300
SYMBOL Res 2720 14304 R0
SYMATTR InstName R57
SYMATTR Value 100
SYMBOL Res 2560 15040 R0
SYMATTR InstName R58
SYMATTR Value 300
SYMBOL Res 2720 15040 R0
SYMATTR InstName R59
SYMATTR Value 100
SYMBOL npn 2640 14944 M0
SYMATTR InstName Q185
SYMATTR Value BC847B
SYMBOL npn 2672 14944 R0
SYMATTR InstName Q186
SYMATTR Value BC847B
SYMBOL Res 2560 14592 R0
SYMATTR InstName R61
SYMATTR Value 20k
SYMBOL pnp 3056 14432 M180
WINDOW 0 64 34 Left 2
WINDOW 3 61 68 Left 2
SYMATTR InstName Q187
SYMATTR Value BC857B
SYMBOL pnp 3024 14432 R180
WINDOW 0 60 32 Left 2
WINDOW 3 58 66 Left 2
SYMATTR InstName Q188
SYMATTR Value BC857B
SYMBOL npn 3024 15024 M0
SYMATTR InstName Q189
SYMATTR Value BC847B
SYMBOL npn 3056 15024 R0
SYMATTR InstName Q190
SYMATTR Value BC847B
SYMBOL Cap 3040 14608 R0
SYMATTR InstName C15
SYMATTR Value 10p
SYMBOL npn 3216 15024 R0
SYMATTR InstName Q191
SYMATTR Value BC847B
SYMBOL npn 3216 14848 R0
SYMATTR InstName Q192
SYMATTR Value BC847B
SYMBOL pnp 3216 14432 M180
WINDOW 0 64 34 Left 2
WINDOW 3 61 68 Left 2
SYMATTR InstName Q193
SYMATTR Value BC857B
SYMBOL pnp 3216 14624 M180
WINDOW 0 64 34 Left 2
WINDOW 3 61 68 Left 2
SYMATTR InstName Q194
SYMATTR Value BC857B
SYMBOL npn 3344 14416 R0
SYMATTR InstName Q195
SYMATTR Value BC847B
SYMBOL pnp 3344 15040 M180
WINDOW 0 64 34 Left 2
WINDOW 3 61 68 Left 2
SYMATTR InstName Q196
SYMATTR Value BC857B
SYMBOL Res 3392 14304 R0
SYMATTR InstName R62
SYMATTR Value 10
SYMBOL Res 3392 15040 R0
SYMATTR InstName R63
SYMATTR Value 10
SYMBOL Res 3520 14736 R0
SYMATTR InstName R64
SYMATTR Value 470
SYMBOL Res 3520 14880 R0
SYMATTR InstName R65
SYMATTR Value 33
SYMBOL ind 3840 14752 R270
WINDOW 0 32 56 VTop 2
WINDOW 3 5 56 VBottom 2
SYMATTR InstName L1
SYMATTR Value 2mH
SYMATTR SpiceLine Rser=120 Cpar=1pF
SYMBOL Cap 3984 14752 R0
SYMATTR InstName C_ant1
SYMATTR Value 10pF
SYMBOL Res 3632 14752 R270
WINDOW 0 32 56 VTop 2
WINDOW 3 0 56 VBottom 2
SYMATTR InstName R66
SYMATTR Value 4.7
SYMBOL Res 3280 14720 R90
WINDOW 0 0 56 VBottom 2
WINDOW 3 32 56 VTop 2
SYMATTR InstName R67
SYMATTR Value 10
SYMBOL Cap 2832 14688 R0
SYMATTR InstName C16
SYMATTR Value 10n
SYMBOL npn 4064 16544 M0
SYMATTR InstName Q56
SYMATTR Value BC847B
SYMBOL npn 3840 16720 R0
SYMATTR InstName Q57
SYMATTR Value BC847B
SYMBOL npn 3744 16544 R0
SYMATTR InstName Q58
SYMATTR Value BC847B
SYMBOL pnp 3872 16272 R180
WINDOW 0 60 32 Left 2
WINDOW 3 58 66 Left 2
SYMATTR InstName Q59
SYMATTR Value BC857B
SYMBOL pnp 3936 16272 M180
WINDOW 0 64 34 Left 2
WINDOW 3 61 68 Left 2
SYMATTR InstName Q60
SYMATTR Value BC857B
SYMBOL pnp 3872 16432 R180
WINDOW 0 60 32 Left 2
WINDOW 3 58 66 Left 2
SYMATTR InstName Q61
SYMATTR Value BC857B
SYMBOL pnp 3936 16432 M180
WINDOW 0 64 34 Left 2
WINDOW 3 61 68 Left 2
SYMATTR InstName Q62
SYMATTR Value BC857B
SYMBOL Cap 4096 16624 R0
SYMATTR InstName C2
SYMATTR Value 560p
SYMBOL npn 4480 16544 M0
SYMATTR InstName Q63
SYMATTR Value BC847B
SYMBOL npn 4256 16720 R0
SYMATTR InstName Q64
SYMATTR Value BC847B
SYMBOL npn 4160 16544 R0
SYMATTR InstName Q65
SYMATTR Value BC847B
SYMBOL pnp 4288 16272 R180
WINDOW 0 60 32 Left 2
WINDOW 3 58 66 Left 2
SYMATTR InstName Q66
SYMATTR Value BC857B
SYMBOL pnp 4352 16272 M180
WINDOW 0 64 34 Left 2
WINDOW 3 61 68 Left 2
SYMATTR InstName Q67
SYMATTR Value BC857B
SYMBOL pnp 4288 16432 R180
WINDOW 0 60 32 Left 2
WINDOW 3 58 66 Left 2
SYMATTR InstName Q68
SYMATTR Value BC857B
SYMBOL pnp 4352 16432 M180
WINDOW 0 64 34 Left 2
WINDOW 3 61 68 Left 2
SYMATTR InstName Q69
SYMATTR Value BC857B
SYMBOL Cap 4496 16624 R0
SYMATTR InstName C3
SYMATTR Value 560p
SYMBOL npn 3232 16544 M0
SYMATTR InstName Q70
SYMATTR Value BC847B
SYMBOL npn 3008 16720 R0
SYMATTR InstName Q71
SYMATTR Value BC847B
SYMBOL npn 2912 16544 R0
SYMATTR InstName Q72
SYMATTR Value BC847B
SYMBOL pnp 3040 16272 R180
WINDOW 0 60 32 Left 2
WINDOW 3 58 66 Left 2
SYMATTR InstName Q73
SYMATTR Value BC857B
SYMBOL pnp 3104 16272 M180
WINDOW 0 64 34 Left 2
WINDOW 3 61 68 Left 2
SYMATTR InstName Q74
SYMATTR Value BC857B
SYMBOL pnp 3040 16432 R180
WINDOW 0 60 32 Left 2
WINDOW 3 58 66 Left 2
SYMATTR InstName Q75
SYMATTR Value BC857B
SYMBOL pnp 3104 16432 M180
WINDOW 0 64 34 Left 2
WINDOW 3 61 68 Left 2
SYMATTR InstName Q76
SYMATTR Value BC857B
SYMBOL Res 3296 16464 R0
SYMATTR InstName R19
SYMATTR Value 180
SYMBOL npn 2848 16544 M0
SYMATTR InstName Q77
SYMATTR Value BC847B
SYMBOL npn 2624 16720 R0
SYMATTR InstName Q78
SYMATTR Value BC847B
SYMBOL npn 2528 16544 R0
SYMATTR InstName Q79
SYMATTR Value BC847B
SYMBOL Res 3296 16608 R0
SYMATTR InstName R20
SYMATTR Value 10
SYMBOL Res 2672 16832 R0
SYMATTR InstName R23
SYMATTR Value 100
SYMBOL Res 3056 16832 R0
SYMATTR InstName R24
SYMATTR Value 100
SYMBOL Res 3888 16832 R0
SYMATTR InstName R25
SYMATTR Value 100
SYMBOL Res 4304 16832 R0
SYMATTR InstName R26
SYMATTR Value 100
SYMBOL Cap 3472 17456 R0
SYMATTR InstName C4
SYMATTR Value 560p
SYMBOL npn 3232 17568 M0
SYMATTR InstName Q94
SYMATTR Value BC847B
SYMBOL npn 3008 17744 R0
SYMATTR InstName Q95
SYMATTR Value BC847B
SYMBOL npn 2912 17568 R0
SYMATTR InstName Q96
SYMATTR Value BC847B
SYMBOL pnp 3040 17296 R180
WINDOW 0 60 32 Left 2
WINDOW 3 58 66 Left 2
SYMATTR InstName Q97
SYMATTR Value BC857B
SYMBOL pnp 3104 17296 M180
WINDOW 0 64 34 Left 2
WINDOW 3 61 68 Left 2
SYMATTR InstName Q98
SYMATTR Value BC857B
SYMBOL pnp 3040 17456 R180
WINDOW 0 60 32 Left 2
WINDOW 3 58 66 Left 2
SYMATTR InstName Q99
SYMATTR Value BC857B
SYMBOL pnp 3104 17456 M180
WINDOW 0 64 34 Left 2
WINDOW 3 61 68 Left 2
SYMATTR InstName Q100
SYMATTR Value BC857B
SYMBOL Res 3904 17488 R0
SYMATTR InstName R27
SYMATTR Value 470
SYMBOL npn 2800 17568 M0
SYMATTR InstName Q101
SYMATTR Value BC847B
SYMBOL npn 2576 17744 R0
SYMATTR InstName Q102
SYMATTR Value BC847B
SYMBOL npn 2480 17568 R0
SYMATTR InstName Q103
SYMATTR Value BC847B
SYMBOL Res 3904 17632 R0
SYMATTR InstName R28
SYMATTR Value 200
SYMBOL Res 2624 17856 R0
SYMATTR InstName R29
SYMATTR Value 100
SYMBOL Res 3056 17856 R0
SYMATTR InstName R30
SYMATTR Value 100
SYMBOL Res 5200 17616 R0
SYMATTR InstName R32
SYMATTR Value 180
SYMBOL Res 5200 17328 R0
SYMATTR InstName R33
SYMATTR Value 3k
SYMBOL Res 5200 17472 R0
SYMATTR InstName R34
SYMATTR Value 20
SYMBOL npn 3632 17792 R0
SYMATTR InstName Q87
SYMATTR Value BC847B
SYMBOL npn 3632 17312 R0
SYMATTR InstName Q88
SYMATTR Value BC847B
SYMBOL Res 3680 17904 R0
SYMATTR InstName R35
SYMATTR Value 100
TEXT -440 13760 Left 2 !.tran 0 17m 0n 1n
TEXT 208 14048 Left 2 !.ic V(RC1)=2.251\n.ic V(RC2)=2.252\n.ic V(INT1)=2.82
TEXT 176 13984 Left 4 ;Amplitude limiter
TEXT 1336 13880 Left 4 ;Variable RC LP \nfilter stage 1
TEXT 1744 13880 Left 4 ;Variable RC LP \nfilter stage 2
TEXT 152 15120 Left 4 ;OTA Based Amplifying \nInverting Integrator\n270 degrees phase shift
TEXT 408 13712 Left 4 ;Wide frequency range VCO for Theremin AFE
TEXT 1544 14976 Left 4 ;Unity gain buffer
TEXT 2832 14048 Left 2 !.ic V(RC1)=2.251\n.ic V(RC2)=2.252\n.ic V(INT1)=2.82
TEXT 2800 13984 Left 4 ;Amplitude limiter
TEXT 2504 14256 Left 3 ;Unity gain output buffer - operational amplifier with current feedback
TEXT 2656 16208 Left 2 !.ic V(ARC1)=2.251\n.ic V(ARC2)=2.252\n.ic V(ARC3)=2.285
TEXT 2624 16144 Left 4 ;Amplitude limiter
TEXT 3784 16040 Left 4 ;Variable RC LP \nfilter stage 1
TEXT 4192 16040 Left 4 ;Variable RC LP \nfilter stage 2
TEXT 2624 17168 Left 4 ;Amplitude limiter

The netlist it stands for:
* vco_sine_bjt_v01.asc
V1 COM 0 4.5
V2 VREF 0 2.25
V19 VCC33 0 3.3
V4 VREF12 0 1.2
Q52 N007 VCOBIAS1 N012 0 BC847B
R60 COM VCOBIAS2 22k
R1 COM VCOBIAS3 4.7k
I1 COM N007 PWL(0 30u 400u 30u 15m 500u)
Q54 VCOBIAS2 VCOBIAS2 N030 0 BC847B
Q55 VCOBIAS3 VCOBIAS3 N047 0 BC847B
Q53 COM N007 VCOBIAS1 0 BC847B
Q12 RC1 RC1 N019 0 BC847B
Q15 N019 VCOBIAS1 N025 0 BC847B
Q11 N009 SIN_AMP N019 0 BC847B
Q17 N005 N002 COM 0 BC857B
Q18 N002 N002 COM 0 BC857B
Q19 N009 N009 N005 0 BC857B
Q20 RC1 N009 N002 0 BC857B
C7 RC1 0 560p
Q14 RC2 RC2 N020 0 BC847B
Q16 N020 VCOBIAS1 N026 0 BC847B
Q13 N010 RC1 N020 0 BC847B
Q21 N006 N003 COM 0 BC857B
Q22 N003 N003 COM 0 BC857B
Q23 N010 N010 N006 0 BC857B
Q24 RC2 N010 N003 0 BC857B
C8 RC2 0 560p
Q26 N038 VREF N045 0 BC847B
Q30 N045 VCOBIAS1 N053 0 BC847B
Q25 N040 RC2 N045 0 BC847B
Q28 N040 SIN_FB N046 0 BC847B
Q33 N046 VCOBIAS1 N056 0 BC847B
Q27 N038 VREF N046 0 BC847B
Q37 N040 N037 COM 0 BC857B
Q38 N044 N037 COM 0 BC857B
C9 INT1 0 39p
Q51 SIN_OUT VCOBIAS3 N049 0 BC847B
R21 SIN_FB VREF 180
R22 SIN_OUT SIN_DIV 3k
Q34 N038 N033 COM 0 BC857B
Q35 INT1 N033 COM 0 BC857B
Q40 N044 N044 N051 0 BC847B
Q41 INT1 N044 N050 0 BC847B
Q42 N051 N050 0 0 BC847B
Q43 N050 N050 0 0 BC847B
Q50 COM N042 SIN_OUT 0 BC847B
Q45 N042 SIN_OUT N043 0 BC847B
Q46 N043 VCOBIAS2 N048 0 BC847B
Q44 N041 INT1 N043 0 BC847B
Q47 N041 N039 COM 0 BC857B
Q48 N042 N039 COM 0 BC857B
Q49 0 N041 N039 0 BC857B
Q29 N045 VCOBIAS1 N052 0 BC847B
R3 SIN_DIV SIN_FB 20
Q36 0 N038 N033 0 BC857B
Q39 0 N040 N037 0 BC857B
Q31 N045 VCOBIAS1 N054 0 BC847B
Q4 SIN_AMP AMP_FB N018 0 BC847B
Q6 N018 VCOBIAS1 N024 0 BC847B
Q3 N008 VREF N018 0 BC847B
Q7 N004 N001 COM 0 BC857B
Q8 N001 N001 COM 0 BC857B
Q9 N008 N008 N004 0 BC857B
Q10 SIN_AMP N008 N001 0 BC857B
R2 SIN_AMP AMP_FB 470
Q2 SIN_AMP VREF N017 0 BC847B
Q5 N017 VCOBIAS2 N023 0 BC847B
Q1 N008 SIN_DIV N017 0 BC847B
R4 AMP_FB VREF 47
R5 N023 0 100
R6 N024 0 100
R7 N025 0 100
R8 N026 0 100
R9 N052 0 100
R10 N053 0 100
R11 N054 0 100
R12 N056 0 100
R13 N048 0 100
R14 N049 0 100
R15 N012 0 100
R16 N047 0 100
R17 N030 0 100
C1 VCOBIAS1 0 1n
Q32 N045 VCOBIAS1 N055 0 BC847B
R18 N055 0 100
R40 COM VCOBIAS22 22k
Q125 VCOBIAS22 VCOBIAS22 N029 0 BC847B
R41 N029 0 100
Q179 N021 BIAS_P N014 0 BC857B
Q180 BIAS_P BIAS_P N013 0 BC857B
Q181 0 SIN_OUT N021 0 BC857B
Q182 COM SIN_OUT N028 0 BC847B
Q183 N031 N028 N027 0 BC857B
Q184 N011 N021 N027 0 BC847B
R56 COM N013 300
R57 COM N014 100
R58 N034 0 300
R59 N035 0 100
Q185 BIAS_N BIAS_N N034 0 BC847B
Q186 N028 BIAS_N N035 0 BC847B
R61 BIAS_P BIAS_N 20k
Q187 N022 N011 COM 0 BC857B
Q188 N011 N011 COM 0 BC857B
Q189 N031 N031 0 0 BC847B
Q190 N022 N031 0 0 BC847B
C15 N022 0 10p
Q191 N032 N031 0 0 BC847B
Q192 COM N022 N032 0 BC847B
Q193 N016 N011 COM 0 BC857B
Q194 0 N022 N016 0 BC857B
Q195 N015 N016 SENSE 0 BC847B
Q196 N036 N032 SENSE 0 BC857B
R62 COM N015 10
R63 N036 0 10
R64 SENSE SNSDIV 470
R65 SNSDIV VREF 33
L1 DRIVE ANT 2mH Rser=120 Cpar=1pF
C_ant1 ANT 0 10pF
R66 SENSE DRIVE 4.7
R67 SENSE N027 10
C16 N021 N028 10n
Q56 ARC1 ARC1 N069 0 BC847B
Q57 N069 VCOBIAS1 N073 0 BC847B
Q58 N064 LIM1 N069 0 BC847B
Q59 N061 N058 COM 0 BC857B
Q60 N058 N058 COM 0 BC857B
Q61 N064 N064 N061 0 BC857B
Q62 ARC1 N064 N058 0 BC857B
C2 ARC1 0 560p
Q63 ARC2 ARC2 N070 0 BC847B
Q64 N070 VCOBIAS1 N074 0 BC847B
Q65 N065 ARC1 N070 0 BC847B
Q66 N062 N059 COM 0 BC857B
Q67 N059 N059 COM 0 BC857B
Q68 N065 N065 N062 0 BC857B
Q69 ARC2 N065 N059 0 BC857B
C3 ARC2 0 560p
Q70 LIM1 N066 N068 0 BC847B
Q71 N068 VCOBIAS1 N072 0 BC847B
Q72 N063 VREF N068 0 BC847B
Q73 N060 N057 COM 0 BC857B
Q74 N057 N057 COM 0 BC857B
Q75 N063 N063 N060 0 BC857B
Q76 LIM1 N063 N057 0 BC857B
R19 LIM1 N066 180
Q77 LIM1 VREF N067 0 BC847B
Q78 N067 VCOBIAS2 N071 0 BC847B
Q79 N063 LIM2 N067 0 BC847B
R20 N066 VREF 10
R23 N071 0 100
R24 N072 0 100
R25 N073 0 100
R26 N074 0 100
C4 ARC3 0 560p
Q94 ARC3 N078 N080 0 BC847B
Q95 N080 VCOBIAS1 N082 0 BC847B
Q96 N077 VREF N080 0 BC847B
Q97 N076 N075 COM 0 BC857B
Q98 N075 N075 COM 0 BC857B
Q99 N077 N077 N076 0 BC857B
Q100 ARC3 N077 N075 0 BC857B
R27 LIM2 N078 470
Q101 ARC3 ARC2 N079 0 BC847B
Q102 N079 VCOBIAS2 N081 0 BC847B
Q103 N077 VREF N079 0 BC847B
R28 N078 VREF 200
R29 N081 0 100
R30 N082 0 100
R32 SIN_FB VREF 180
R33 SIN_OUT SIN_DIV 3k
R34 SIN_DIV SIN_FB 20
Q87 LIM2 VCOBIAS3 N083 0 BC847B
Q88 COM ARC3 LIM2 0 BC847B
R35 N083 0 100
.model NPN NPN
.model PNP PNP
.lib standard.bjt
.tran 0 17m 0n 1n
.ic V(RC1)=2.251
.ic V(RC2)=2.252
.ic V(INT1)=2.82
* Amplitude limiter
* Variable RC LP
* filter stage 1
* Variable RC LP
* filter stage 2
* OTA Based Amplifying
* Inverting Integrator
* 270 degrees phase shift
* Wide frequency range VCO for Theremin AFE
* Unity gain buffer
.ic V(RC1)=2.251
.ic V(RC2)=2.252
.ic V(INT1)=2.82
* Amplitude limiter
* Unity gain output buffer - operational amplifier with current feedback
.ic V(ARC1)=2.251
.ic V(ARC2)=2.252
.ic V(ARC3)=2.285
* Amplitude limiter
* Variable RC LP
* filter stage 1
* Variable RC LP
* filter stage 2
* Amplitude limiter
.backanno
.end